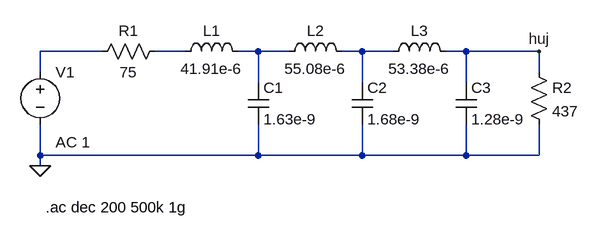
[diagram p0: schematic RLC_filter.asc]
RLC_filter.asc, the LTspice schematic file:
Version 4
SHEET 1 880 680
WIRE 48 96 -48 96
WIRE 176 96 128 96
WIRE 288 96 256 96
WIRE 336 96 288 96
WIRE 448 96 416 96
WIRE 496 96 448 96
WIRE 608 96 576 96
WIRE 720 96 608 96
WIRE -48 128 -48 96
WIRE 720 128 720 96
WIRE 288 144 288 96
WIRE 448 144 448 96
WIRE 608 144 608 96
WIRE -48 256 -48 208
WIRE 288 256 288 208
WIRE 288 256 -48 256
WIRE 448 256 448 208
WIRE 448 256 288 256
WIRE 608 256 608 208
WIRE 608 256 448 256
WIRE 720 256 720 208
WIRE 720 256 608 256
WIRE -48 272 -48 256
FLAG -48 272 0
FLAG 720 96 huj
SYMBOL res 144 80 R90
WINDOW 0 0 56 VBottom 2
WINDOW 3 32 56 VTop 2
SYMATTR InstName R1
SYMATTR Value 75
SYMBOL ind 160 112 R270
WINDOW 0 32 56 VTop 2
WINDOW 3 5 56 VBottom 2
SYMATTR InstName L1
SYMATTR Value 41.91e-6
SYMBOL cap 272 144 R0
SYMATTR InstName C1
SYMATTR Value 1.63e-9
SYMBOL ind 320 112 R270
WINDOW 0 32 56 VTop 2
WINDOW 3 5 56 VBottom 2
SYMATTR InstName L2
SYMATTR Value 55.08e-6
SYMBOL cap 432 144 R0
SYMATTR InstName C2
SYMATTR Value 1.68e-9
SYMBOL ind 480 112 R270
WINDOW 0 32 56 VTop 2
WINDOW 3 5 56 VBottom 2
SYMATTR InstName L3
SYMATTR Value 53.38e-6
SYMBOL cap 592 144 R0
SYMATTR InstName C3
SYMATTR Value 1.28e-9
SYMBOL res 704 112 R0
SYMATTR InstName R2
SYMATTR Value 437
SYMBOL voltage -48 112 R0
WINDOW 123 24 124 Left 2
WINDOW 39 0 0 Left 0
SYMATTR InstName V1
SYMATTR Value ""
SYMATTR Value2 AC 1
TEXT -40 336 Left 2 !.ac dec 200 500k 1g

The netlist it stands for:
* RLC_filter.asc
R1 N002 N001 75
L1 N002 N003 41.91e-6
C1 N003 0 1.63e-9
L2 N003 N004 55.08e-6
C2 N004 0 1.68e-9
L3 N004 huj 53.38e-6
C3 huj 0 1.28e-9
R2 huj 0 437
V1 N001 0 AC 1
.ac dec 200 500k 1g
.backanno
.end